# Altium schematic sheet Main.SchDoc
size B; SheetNumber: 1; SheetTotal: 11
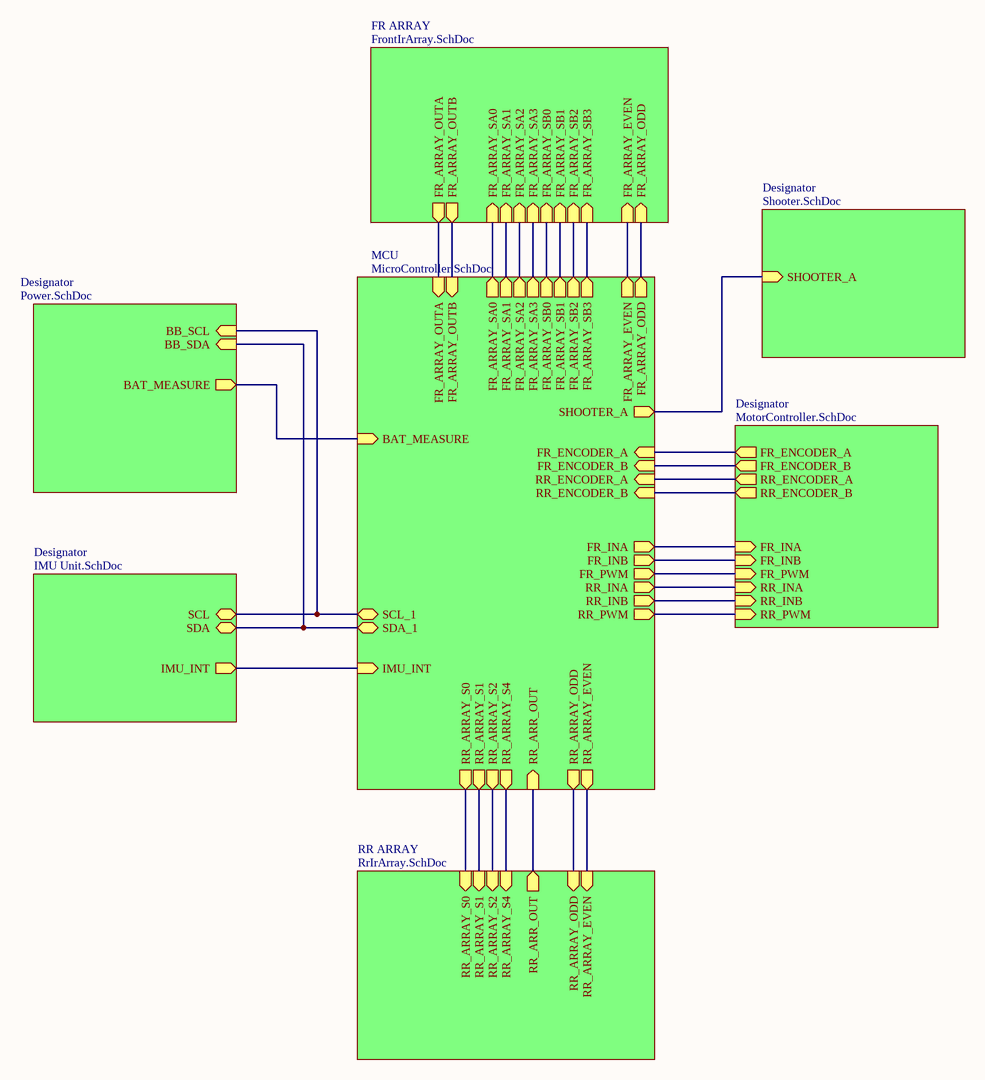
[diagram p0: Main.SchDoc]

## Sub-sheets
Designator = MotorController.SchDoc: FR_ENCODER_A (out), FR_ENCODER_B (out), RR_ENCODER_A (out), RR_ENCODER_B (out), FR_INA (in), FR_INB (in), FR_PWM (in), RR_INA (in), RR_INB (in), RR_PWM (in)
Designator = Shooter.SchDoc: SHOOTER_A (in)
Designator = IMU Unit.SchDoc: SCL (bidir), SDA (bidir), IMU_INT (out)
Designator = Power.SchDoc: BAT_MEASURE (out), BB_SCL (in), BB_SDA (in)
FR ARRAY = FrontIrArray.SchDoc: FR_ARRAY_SA0 (in), FR_ARRAY_SA1 (in), FR_ARRAY_SA2 (in), FR_ARRAY_SA3 (in), FR_ARRAY_SB0 (in), FR_ARRAY_SB1 (in), FR_ARRAY_SB2 (in), FR_ARRAY_SB3 (in), FR_ARRAY_OUTA (out), FR_ARRAY_OUTB (out), FR_ARRAY_EVEN (in), FR_ARRAY_ODD (in)
MCU = MicroController.SchDoc: SCL_1 (bidir), SDA_1 (bidir), IMU_INT (in), FR_ENCODER_A (in), FR_ENCODER_B (in), RR_ENCODER_A (in), RR_ENCODER_B (in), FR_INA (out), FR_INB (out), FR_PWM (out), RR_INA (out), RR_INB (out), RR_PWM (out), RR_ARRAY_S0 (out), RR_ARRAY_S1 (out), RR_ARRAY_S2 (out), RR_ARRAY_S4 (out), RR_ARR_OUT (in), FR_ARRAY_SA0 (out), FR_ARRAY_SA1 (out), FR_ARRAY_SA2 (out), FR_ARRAY_SA3 (out), FR_ARRAY_SB0 (out), FR_ARRAY_SB1 (out), FR_ARRAY_SB2 (out), FR_ARRAY_SB3 (out), FR_ARRAY_OUTA (in), FR_ARRAY_OUTB (in), BAT_MEASURE (in), SHOOTER_A (out), FR_ARRAY_EVEN (out), FR_ARRAY_ODD (out), RR_ARRAY_ODD (out), RR_ARRAY_EVEN (out)
RR ARRAY = RrIrArray.SchDoc: RR_ARRAY_S0 (in), RR_ARRAY_S1 (in), RR_ARRAY_S2 (in), RR_ARRAY_S4 (in), RR_ARR_OUT (out), RR_ARRAY_ODD (in), RR_ARRAY_EVEN (in)

## Nets
(unnamed): sheet MCU/SCL_1, sheet Designator/SCL, sheet Designator/BB_SCL
(unnamed): sheet MCU/SDA_1, sheet Designator/SDA, sheet Designator/BB_SDA
(unnamed): sheet MCU/IMU_INT, sheet Designator/IMU_INT
(unnamed): sheet MCU/FR_ENCODER_A, sheet Designator/FR_ENCODER_A
(unnamed): sheet MCU/FR_ENCODER_B, sheet Designator/FR_ENCODER_B
(unnamed): sheet MCU/RR_ENCODER_A, sheet Designator/RR_ENCODER_A
(unnamed): sheet MCU/RR_ENCODER_B, sheet Designator/RR_ENCODER_B
(unnamed): sheet MCU/FR_INA, sheet Designator/FR_INA
(unnamed): sheet MCU/FR_INB, sheet Designator/FR_INB
(unnamed): sheet MCU/FR_PWM, sheet Designator/FR_PWM
(unnamed): sheet MCU/RR_INA, sheet Designator/RR_INA
(unnamed): sheet MCU/RR_INB, sheet Designator/RR_INB
(unnamed): sheet MCU/RR_PWM, sheet Designator/RR_PWM
(unnamed): sheet MCU/RR_ARRAY_S0, sheet RR ARRAY/RR_ARRAY_S0
(unnamed): sheet MCU/RR_ARRAY_S1, sheet RR ARRAY/RR_ARRAY_S1
(unnamed): sheet MCU/RR_ARRAY_S2, sheet RR ARRAY/RR_ARRAY_S2
(unnamed): sheet MCU/RR_ARRAY_S4, sheet RR ARRAY/RR_ARRAY_S4
(unnamed): sheet MCU/RR_ARR_OUT, sheet RR ARRAY/RR_ARR_OUT
(unnamed): sheet MCU/FR_ARRAY_SA0, sheet FR ARRAY/FR_ARRAY_SA0
(unnamed): sheet MCU/FR_ARRAY_SA1, sheet FR ARRAY/FR_ARRAY_SA1
(unnamed): sheet MCU/FR_ARRAY_SA2, sheet FR ARRAY/FR_ARRAY_SA2
(unnamed): sheet MCU/FR_ARRAY_SA3, sheet FR ARRAY/FR_ARRAY_SA3
(unnamed): sheet MCU/FR_ARRAY_SB0, sheet FR ARRAY/FR_ARRAY_SB0
(unnamed): sheet MCU/FR_ARRAY_SB1, sheet FR ARRAY/FR_ARRAY_SB1
(unnamed): sheet MCU/FR_ARRAY_SB2, sheet FR ARRAY/FR_ARRAY_SB2
(unnamed): sheet MCU/FR_ARRAY_SB3, sheet FR ARRAY/FR_ARRAY_SB3
(unnamed): sheet MCU/FR_ARRAY_OUTA, sheet FR ARRAY/FR_ARRAY_OUTA
(unnamed): sheet MCU/FR_ARRAY_OUTB, sheet FR ARRAY/FR_ARRAY_OUTB
(unnamed): sheet MCU/BAT_MEASURE, sheet Designator/BAT_MEASURE
(unnamed): sheet MCU/SHOOTER_A, sheet Designator/SHOOTER_A
(unnamed): sheet MCU/FR_ARRAY_EVEN, sheet FR ARRAY/FR_ARRAY_EVEN
(unnamed): sheet MCU/FR_ARRAY_ODD, sheet FR ARRAY/FR_ARRAY_ODD
(unnamed): sheet MCU/RR_ARRAY_ODD, sheet RR ARRAY/RR_ARRAY_ODD
(unnamed): sheet MCU/RR_ARRAY_EVEN, sheet RR ARRAY/RR_ARRAY_EVEN